# Altium schematic sheet LED_Driver_NE2R757GT-P6.SchDoc: STB Light Board - red
size A4; Author: flmoll; DrawnBy: flmoll; Organization: PBL; Revision: A; SheetNumber: 19; SheetTotal: 20
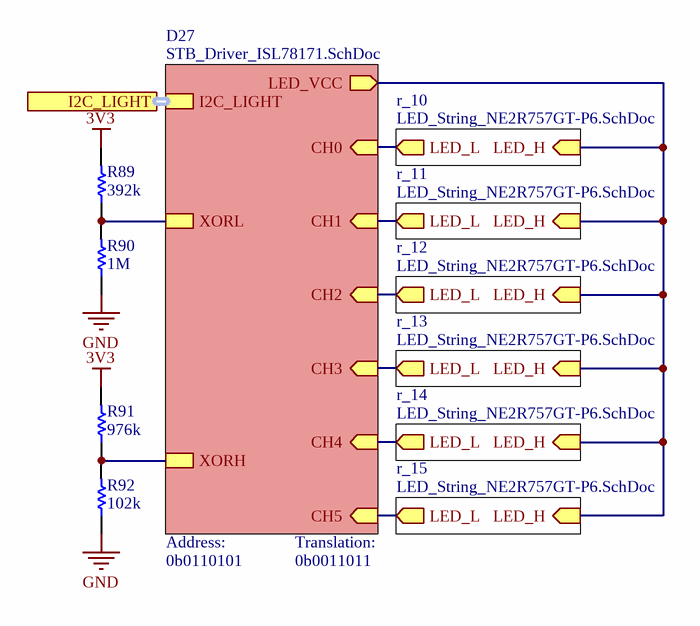
[diagram p0: LED_Driver_NE2R757GT-P6.SchDoc]

## Parts
R89  392k  [RESC1005X40X25LL05T05]
R90  1M  [RESC1005X40X25LL05T05]
R91  976k  [RESC1005X40X25LL05T05]
R92  102k  [RESC1005X40X25LL05T05]

## Sub-sheets
D27 = STB_Driver_ISL78171.SchDoc: CH0 (in), XORL, XORH, LED_VCC (out), CH1 (in), CH2 (in), CH3 (in), CH4 (in), CH5 (in), I2C_LIGHT (harness I2C_LIGHT)
r_10 = LED_String_NE2R757GT-P6.SchDoc: LED_H (in), LED_L (out)
r_11 = LED_String_NE2R757GT-P6.SchDoc: LED_H (in), LED_L (out)
r_12 = LED_String_NE2R757GT-P6.SchDoc: LED_H (in), LED_L (out)
r_13 = LED_String_NE2R757GT-P6.SchDoc: LED_H (in), LED_L (out)
r_14 = LED_String_NE2R757GT-P6.SchDoc: LED_H (in), LED_L (out)
r_15 = LED_String_NE2R757GT-P6.SchDoc: LED_H (in), LED_L (out)

## Ports
I2C_LIGHT (harness I2C_LIGHT, see STB_LightBoard[5C], LED_Driver_AREM-80C0[1A], LED_Driver_AREM-90C0[1A], LED_Driver_NE2B757GT[2B], LED_Driver_NE2G757GT[2B], LED_Driver_NF2L757GT-F1[1A], LED_Driver_NF2W757GT-F1[1A], LED_Driver_QBHP686[1A], STB_Driver_ISL78171[1A], STB_FanControl[1A], STB_UID[1A])

## Nets
3V3: R89.2 R91.2
GND: R90.1 R92.1
NetR89_1: R89.1 R90.2 ; sheet D27/XORL
NetR91_1: R91.1 R92.2 ; sheet D27/XORH
(unnamed): sheet D27/CH0, sheet r_10/LED_L
(unnamed): sheet D27/LED_VCC, sheet r_10/LED_H, sheet r_11/LED_H, sheet r_12/LED_H, sheet r_13/LED_H, sheet r_14/LED_H, sheet r_15/LED_H
(unnamed): sheet D27/CH1, sheet r_11/LED_L
(unnamed): sheet D27/CH2, sheet r_12/LED_L
(unnamed): sheet D27/CH3, sheet r_13/LED_L
(unnamed): sheet D27/CH4, sheet r_14/LED_L
(unnamed): sheet D27/CH5, sheet r_15/LED_L

## Buses and harness runs
harness port I2C_LIGHT = sheet D27/I2C_LIGHT

## Notes on the sheet
- (near R92) Address:
- 0b0110101
- Translation:
- 0b0011011
- 1
- 2
- 3
- 4
- A
- B
- C
- Project:
- D
- Date:
- Drawing number:
- Rev:
- Format:
- A4 Q
- Drawn by:
- Laboratory:
- Page
- Sheet:
- of
- File:

## Library data of the parts
R89 = CMP-2002-00914-1: Part Number: ERJ-2RKF3923X; Manufacturer: Panasonic; Tolerance: 1%; Rated Power Dissipation (P): 100mW; Rated Temperature: 70°C; Value: 392 kOhm; Temperature Coefficient: 100ppm/°C; Working Voltage: 50V; Package Height: 0.35mm; Package Length: 1mm; Package Width: 0.5mm; Reference Standard: AEC-Q200; Supplier 1: Digi-Key; Supplier Part Number 1: P392KLDKR-ND; Manufacturer Part Number: ERJ-2RKF3923X; RoHS: Yes; Category: Chip SMD Resistors; Stock 1: 100496; Pricing 1: 1=0.10000, 10=0.03300, 100=0.01330, 1000=0.00599, 2500=0.00520, 5000=0.00429 (USD); Mount: Surface Mount; Number of Pins: 2; Size Code: 0402; Terminal Finish: Nickel; Package Shape: Rectangular; Min Operating Temperature: -55°C; Max Operating Temperature: 155°C; JESD-609 Code: e3; Resistor Type: FIXED RESISTOR; Construction: Rectangular; Package Style: SMTMeter; Packaging: Tape and Reel; Technology: METAL GLAZE/THICK FILM; Termination: Wraparound; Reach SVHC Compliant: Yes; RoHS Compliant: Yes; ComponentLink1URL: https://datasheet.ciiva.com:443/pdfs/VipMasterIC/IC/PANA/PANA-S-A0009889626/PANA-S-A0009889626-1.pdf?src-supplier=IHS+Markit; ComponentLink1Description: https://datasheet.ciiva.com:443/pdfs/VipMasterIC/IC/PANA/PANA-S-A0009889626/PANA-S-A0009889626-1.pdf?src-supplier=IHS+Markit; ComponentLink2URL: https://datasheet.ciiva.com/24069/aoa0000ce2-24069223.pdf?src-supplier=Mouser; ComponentLink2Description: https://datasheet.ciiva.com/24069/aoa0000ce2-24069223.pdf?src-supplier=Mouser; ComponentLink3URL: https://datasheet.ciiva.com/30085/aoa0000ce2-30085781.pdf?src-supplier=Onlinecomponents.com; ComponentLink3Description: https://datasheet.ciiva.com/30085/aoa0000ce2-30085781.pdf?src-supplier=Onlinecomponents.com; ComponentLink4URL: https://datasheet.ciiva.com/16781/70260748-16781463.pdf?src-supplier=Allied+Electronics; ComponentLink4Description: https://datasheet.ciiva.com/16781/70260748-16781463.pdf?src-supplier=Allied+Electronics; ComponentLink5URL: https://datasheet.ciiva.com/22673/1678782-22673356.pdf?src-supplier=Element14; ComponentLink5Description: https://datasheet.ciiva.com/22673/1678782-22673356.pdf?src-supplier=Element14; ComponentLink6URL: https://datasheet.ciiva.com/46399/1678782-46399980.pdf?src-supplier=Element14; ComponentLink6Description: https://datasheet.ciiva.com/46399/1678782-46399980.pdf?src-supplier=Element14; ComponentLink7URL: https://datasheet.ciiva.com/46399/1678782-46399981.pdf?src-supplier=Element14; ComponentLink7Description: https://datasheet.ciiva.com/46399/1678782-46399981.pdf?src-supplier=Element14; ComponentLink8URL: https://datasheet.ciiva.com/22776/1678782-22776542.pdf?src-supplier=Farnell; ComponentLink8Description: https://datasheet.ciiva.com/22776/1678782-22776542.pdf?src-supplier=Farnell; ComponentLink9URL: https://datasheet.ciiva.com/16774/70260748-16774815.pdf?src-supplier=Allied+Electronics; ComponentLink9Description: https://datasheet.ciiva.com/16774/70260748-16774815.pdf?src-supplier=Allied+Electronics
R90 = CMP-2002-00609-3: Chip Resistor, 1 MOhm, +/- 1%, 100 mW, -55 to 155 degC, 0402 (1005 Metric), RoHS, Tape and Reel; PartNumber: ERJ-2RKF1004X; Manufacturer: Basic Passives; Voltage Rating: 50 V; Case\/Package: 0402; Value: 1 MOhm; Power Rating: 100 mW; Rated Power Dissipation (P): 100mW; Temperature Coefficient: 100ppm/°C; Working Voltage: 50V; Rated Temperature: 70°C; Package Height: 0.35mm; Package Length: 1mm; Package Width: 0.5mm; Reference Standard: AEC-Q200; Pins: 2; Max Operating Temperature: 155 degC; ComponentLink2URL: http://industrial.panasonic.com/cdbs/www-data/pdf/RDA0000/AOA0000C86.pdf; Weight: 2.8E-05oz; ComponentLink1URL: http://www.panasonic.com/; Radiation Hardening: No; Height: 0.35 mm; Case Code (Imperial): 0402; ComponentLink2Description: Datasheet; Mount: Surface Mount; ComponentLink1Description: Manufacturer URL; REACH SVHC: Yes; Length: 1 mm; Min Operating Temperature: -55 degC; Width: 0.5 mm; Package Quantity: 10000; Tolerance: 1%; PackageDescription: 2-Pin Surface Mount Device, Body 1 x 0.5 mm; RoHSCompliant: true; DatasheetVersion: 04/2015; PackageReference: 0402; Mounting Technology: Surface Mount; Case Code (Metric): 1005; Packaging: Tape and Reel; Supplier 1: Digi-Key; Supplier Part Number 1: P1.00MLDKR-ND; Manufacturer Part Number: ERJ-2RKF1004X; RoHS: Yes; Category: Chip SMD Resistors; Stock 1: 1012879; Pricing 1: 1=0.10000, 10=0.03300, 100=0.01330, 1000=0.00599, 2500=0.00520, 5000=0.00429 (USD); Number of Pins: 2; Package Shape: Rectangular; Size Code: 0402; Terminal Finish: Nickel; JESD-609 Code: e3; Resistor Type: FIXED RESISTOR; Construction: Rectangular; Package Style: SMTMeter; Technology: METAL GLAZE/THICK FILM; Termination: Wraparound; Reach SVHC Compliant: Yes; RoHS Compliant: Yes; ComponentLink3URL: https://datasheet.ciiva.com:443/pdfs/VipMasterIC/IC/PANA/PANA-S-A0009889626/PANA-S-A0009889626-1.pdf?src-supplier=IHS+Markit; ComponentLink3Description: https://datasheet.ciiva.com:443/pdfs/VipMasterIC/IC/PANA/PANA-S-A0009889626/PANA-S-A0009889626-1.pdf?src-supplier=IHS+Markit; ComponentLink4URL: https://datasheet.ciiva.com/34303/1987046-34303551.pdf?src-supplier=Jameco; ComponentLink4Description: https://datasheet.ciiva.com/34303/1987046-34303551.pdf?src-supplier=Jameco; ComponentLink5URL: https://datasheet.ciiva.com/11821/0900766b80f80784-11821229.pdf?src-supplier=RSComponents; ComponentLink5Description: https://datasheet.ciiva.com/11821/0900766b80f80784-11821229.pdf?src-supplier=RSComponents; ComponentLink6URL: https://datasheet.ciiva.com/7909/aoa0000ce2-7909180.pdf?src-supplier=Element14; ComponentLink6Description: https://datasheet.ciiva.com/7909/aoa0000ce2-7909180.pdf?src-supplier=Element14; ComponentLink7URL: https://datasheet.ciiva.com/22723/1678782-22723164.pdf?src-supplier=Element14; ComponentLink7Description: https://datasheet.ciiva.com/22723/1678782-22723164.pdf?src-supplier=Element14; ComponentLink8URL: https://datasheet.ciiva.com/24158/aoa0000ce2-24158990.pdf?src-supplier=Mouser; ComponentLink8Description: https://datasheet.ciiva.com/24158/aoa0000ce2-24158990.pdf?src-supplier=Mouser; ComponentLink9URL: https://datasheet.ciiva.com/16766/70260748-16766711.pdf?src-supplier=Allied+Electronics; ComponentLink9Description: https://datasheet.ciiva.com/16766/70260748-16766711.pdf?src-supplier=Allied+Electronics; ComponentLink10URL: https://datasheet.ciiva.com/16779/70260748-16779288.pdf?src-supplier=Allied+Electronics; ComponentLink10Description: https://datasheet.ciiva.com/16779/70260748-16779288.pdf?src-supplier=Allied+Electronics; ComponentLink11URL: https://datasheet.ciiva.com/16199/aoa0000ce2-16199544.pdf?src-supplier=Future+Electronics; ComponentLink11Description: https://datasheet.ciiva.com/16199/aoa0000ce2-16199544.pdf?src-supplier=Future+Electronics
R91 = CMP-2002-01120-1: Manufacturer: Panasonic; Part Number: ERJ-2RKF9763X; Tolerance: 1%; Rated Power Dissipation (P): 100mW; Rated Temperature: 70°C; Value: 976 kOhm; Temperature Coefficient: 100ppm/°C; Working Voltage: 50V; Package Height: 0.35mm; Package Length: 1mm; Package Width: 0.5mm; Reference Standard: AEC-Q200; Supplier 1: Digi-Key; Supplier Part Number 1: P976KLCT-ND; Manufacturer Part Number: ERJ-2RKF9763X; RoHS: Yes; Category: Chip SMD Resistors; Stock 1: 136638; Pricing 1: 1=0.10000, 10=0.03300, 100=0.01330, 1000=0.00599, 2500=0.00520, 5000=0.00429 (USD); Mount: Surface Mount; Number of Pins: 2; Size Code: 0402; Terminal Finish: Nickel; Package Shape: Rectangular; Min Operating Temperature: -55°C; Max Operating Temperature: 155°C; Resistor Type: FIXED RESISTOR; Construction: Rectangular; Package Style: SMTMeter; Packaging: Tape and Reel; Termination: Wraparound; JESD-609 Code: e3; Technology: METAL GLAZE/THICK FILM; Reach SVHC Compliant: Yes; RoHS Compliant: Yes; ComponentLink1URL: https://datasheet.ciiva.com:443/pdfs/VipMasterIC/IC/PANA/PANA-S-A0009889626/PANA-S-A0009889626-1.pdf?src-supplier=IHS+Markit; ComponentLink1Description: https://datasheet.ciiva.com:443/pdfs/VipMasterIC/IC/PANA/PANA-S-A0009889626/PANA-S-A0009889626-1.pdf?src-supplier=IHS+Markit; ComponentLink2URL: https://datasheet.ciiva.com/43467/1678782-43467581.pdf?src-supplier=Farnell; ComponentLink2Description: https://datasheet.ciiva.com/43467/1678782-43467581.pdf?src-supplier=Farnell; ComponentLink3URL: https://datasheet.ciiva.com/46372/1678782-46372911.pdf?src-supplier=Element14; ComponentLink3Description: https://datasheet.ciiva.com/46372/1678782-46372911.pdf?src-supplier=Element14; ComponentLink4URL: https://datasheet.ciiva.com/22668/1678782-22668415.pdf?src-supplier=Element14; ComponentLink4Description: https://datasheet.ciiva.com/22668/1678782-22668415.pdf?src-supplier=Element14; ComponentLink5URL: https://datasheet.ciiva.com/16758/70260748-16758903.pdf?src-supplier=Allied+Electronics; ComponentLink5Description: https://datasheet.ciiva.com/16758/70260748-16758903.pdf?src-supplier=Allied+Electronics; ComponentLink6URL: https://datasheet.ciiva.com/9179/aoa0000ce2-9179357.pdf?src-supplier=Avnet; ComponentLink6Description: https://datasheet.ciiva.com/9179/aoa0000ce2-9179357.pdf?src-supplier=Avnet; ComponentLink7URL: https://datasheet.ciiva.com/30176/aoa0000ce2-30176831.pdf?src-supplier=Onlinecomponents.com; ComponentLink7Description: https://datasheet.ciiva.com/30176/aoa0000ce2-30176831.pdf?src-supplier=Onlinecomponents.com
R92 = CMP-2002-00613-1: Manufacturer: Panasonic; Part Number: ERJ-2RKF1023X; Tolerance: 1%; Rated Power Dissipation (P): 100mW; Rated Temperature: 70°C; Value: 102 kOhm; Temperature Coefficient: 100ppm/°C; Working Voltage: 50V; Package Height: 0.35mm; Package Length: 1mm; Package Width: 0.5mm; Reference Standard: AEC-Q200; Supplier 1: Digi-Key; Supplier Part Number 1: P102KLDKR-ND; Manufacturer Part Number: ERJ-2RKF1023X; RoHS: Yes; Category: Chip SMD Resistors; Stock 1: 79400; Pricing 1: 1=0.10000, 10=0.03300, 100=0.01330, 1000=0.00599, 2500=0.00520, 5000=0.00429 (USD); Mount: Surface Mount; Number of Pins: 2; Size Code: 0402; Terminal Finish: Nickel; Package Shape: Rectangular; Min Operating Temperature: -55°C; Max Operating Temperature: 155°C; Resistor Type: FIXED RESISTOR; Construction: Rectangular; Package Style: SMTMeter; Packaging: Tape and Reel; Technology: METAL GLAZE/THICK FILM; Termination: Wraparound; JESD-609 Code: e3; Reach SVHC Compliant: Yes; RoHS Compliant: Yes; ComponentLink1URL: https://datasheet.ciiva.com:443/pdfs/VipMasterIC/IC/PANA/PANA-S-A0009889626/PANA-S-A0009889626-1.pdf?src-supplier=IHS+Markit; ComponentLink1Description: https://datasheet.ciiva.com:443/pdfs/VipMasterIC/IC/PANA/PANA-S-A0009889626/PANA-S-A0009889626-1.pdf?src-supplier=IHS+Markit; ComponentLink2URL: https://datasheet.ciiva.com/43467/1678782-43467481.pdf?src-supplier=Farnell; ComponentLink2Description: https://datasheet.ciiva.com/43467/1678782-43467481.pdf?src-supplier=Farnell; ComponentLink3URL: https://datasheet.ciiva.com/9119/aoa0000ce2-9119242.pdf?src-supplier=Avnet; ComponentLink3Description: https://datasheet.ciiva.com/9119/aoa0000ce2-9119242.pdf?src-supplier=Avnet; ComponentLink4URL: https://datasheet.ciiva.com/16781/70260748-16781503.pdf?src-supplier=Allied+Electronics; ComponentLink4Description: https://datasheet.ciiva.com/16781/70260748-16781503.pdf?src-supplier=Allied+Electronics; ComponentLink5URL: https://datasheet.ciiva.com/22673/1678782-22673487.pdf?src-supplier=Element14; ComponentLink5Description: https://datasheet.ciiva.com/22673/1678782-22673487.pdf?src-supplier=Element14; ComponentLink6URL: https://datasheet.ciiva.com/16763/70260748-16763080.pdf?src-supplier=Allied+Electronics; ComponentLink6Description: https://datasheet.ciiva.com/16763/70260748-16763080.pdf?src-supplier=Allied+Electronics; ComponentLink7URL: https://datasheet.ciiva.com/7712/1678782-7712798.pdf?src-supplier=Element14; ComponentLink7Description: https://datasheet.ciiva.com/7712/1678782-7712798.pdf?src-supplier=Element14; ComponentLink8URL: https://datasheet.ciiva.com/46373/1678782-46373215.pdf?src-supplier=Element14; ComponentLink8Description: https://datasheet.ciiva.com/46373/1678782-46373215.pdf?src-supplier=Element14